# EAGLE design Ring_light_PCB (EAGLE 9.6.0)

## Sheet 1 of 2
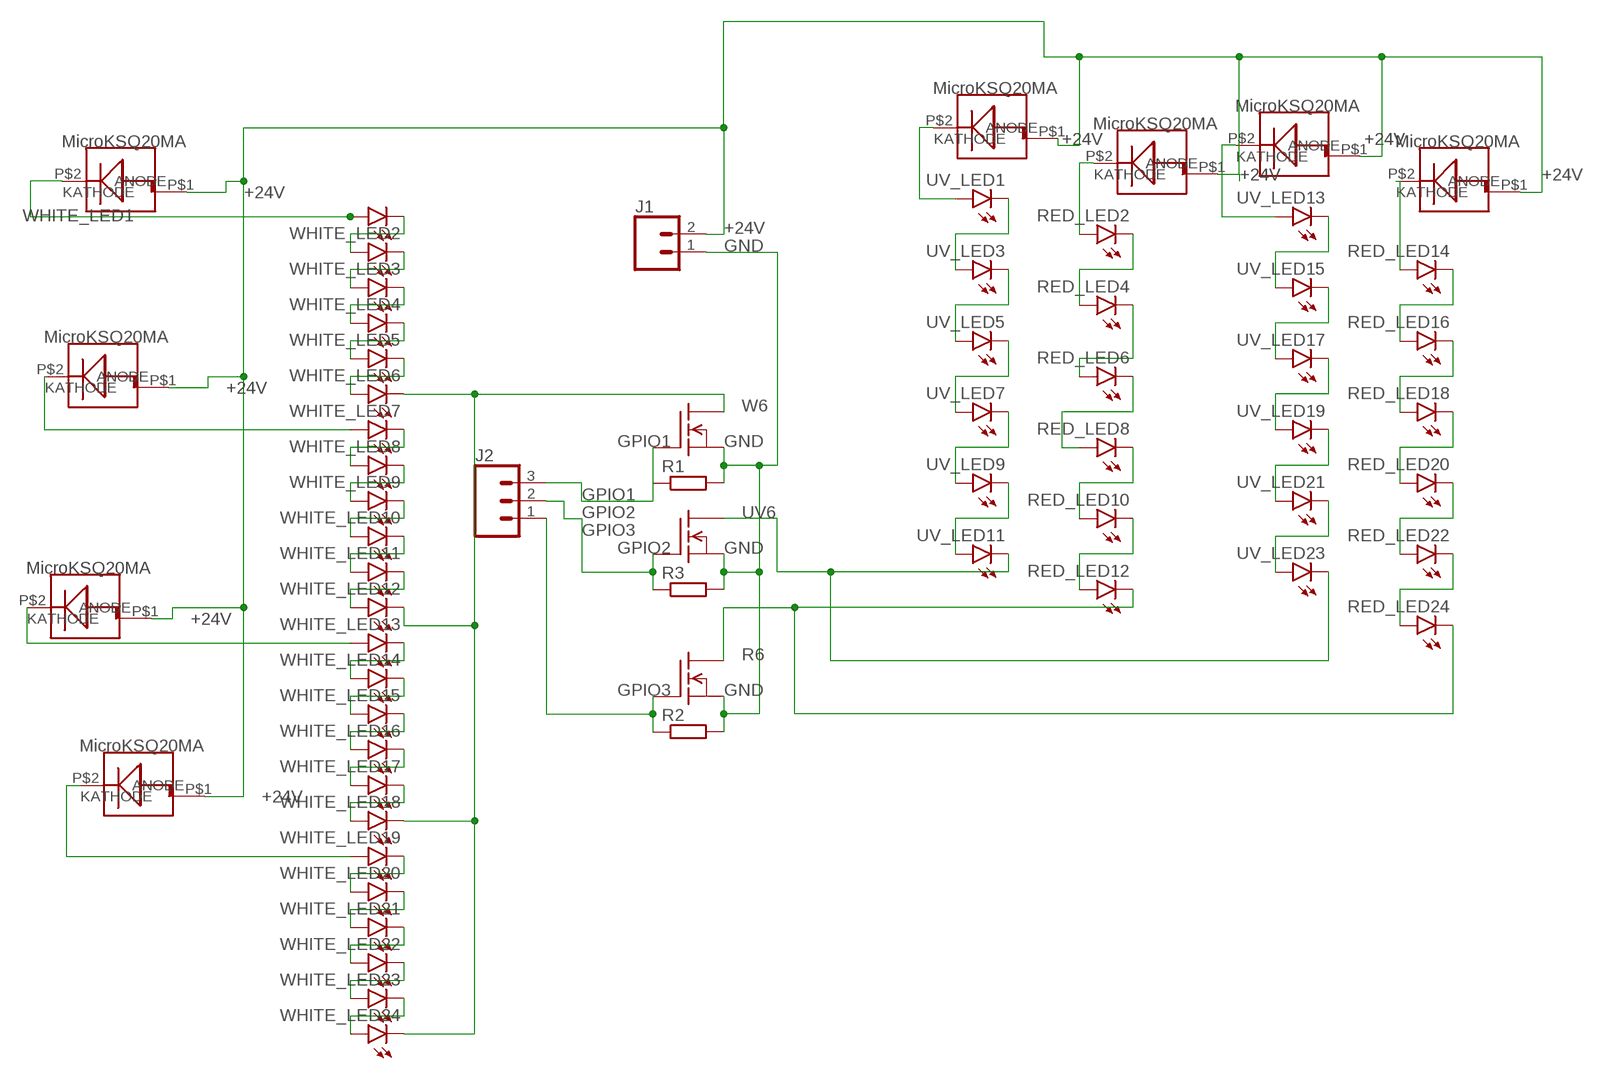
[diagram p0: schematic, sheet 1]

### Parts
J1  CONN_025MM  [SCREWTERMINAL-5MM-2]
J2  CONN_03-SCREW-5MM  [SCREWTERMINAL-5MM-3]
Q1  BUZ10  [TO220]
Q2  BUZ10  [TO220]
Q4  BUZ10  [TO220]
R1  R-EU_0204/7  [0204/7]
R2  R-EU_0204/7  [0204/7]
R3  R-EU_0204/7  [0204/7]
RED_LED2  LED5MM  [LED5MM]
RED_LED4  LED5MM  [LED5MM]
RED_LED6  LED5MM  [LED5MM]
RED_LED8  LED5MM  [LED5MM]
RED_LED10  LED5MM  [LED5MM]
RED_LED12  LED5MM  [LED5MM]
RED_LED14  LED5MM  [LED5MM]
RED_LED16  LED5MM  [LED5MM]
RED_LED18  LED5MM  [LED5MM]
RED_LED20  LED5MM  [LED5MM]
RED_LED22  LED5MM  [LED5MM]
RED_LED24  LED5MM  [LED5MM]
U$1  MICROKSQ220MA  [MICROKSQ20MA]
U$2  MICROKSQ220MA  [MICROKSQ20MA]
U$3  MICROKSQ220MA  [MICROKSQ20MA]
U$4  MICROKSQ220MA  [MICROKSQ20MA]
U$5  MICROKSQ220MA  [MICROKSQ20MA]
U$6  MICROKSQ220MA  [MICROKSQ20MA]
U$7  MICROKSQ220MA  [MICROKSQ20MA]
U$8  MICROKSQ220MA  [MICROKSQ20MA]
UV_LED1  LED5MM  [LED5MM]
UV_LED3  LED5MM  [LED5MM]
UV_LED5  LED5MM  [LED5MM]
UV_LED7  LED5MM  [LED5MM]
UV_LED9  LED5MM  [LED5MM]
UV_LED11  LED5MM  [LED5MM]
UV_LED13  LED5MM  [LED5MM]
UV_LED15  LED5MM  [LED5MM]
UV_LED17  LED5MM  [LED5MM]
UV_LED19  LED5MM  [LED5MM]
UV_LED21  LED5MM  [LED5MM]
UV_LED23  LED5MM  [LED5MM]
WHITE_LED1  LED5MM  [LED5MM]
WHITE_LED2  LED5MM  [LED5MM]
WHITE_LED3  LED5MM  [LED5MM]
WHITE_LED4  LED5MM  [LED5MM]
WHITE_LED5  LED5MM  [LED5MM]
WHITE_LED6  LED5MM  [LED5MM]
WHITE_LED7  LED5MM  [LED5MM]
WHITE_LED8  LED5MM  [LED5MM]
WHITE_LED9  LED5MM  [LED5MM]
WHITE_LED10  LED5MM  [LED5MM]
WHITE_LED11  LED5MM  [LED5MM]
WHITE_LED12  LED5MM  [LED5MM]
WHITE_LED13  LED5MM  [LED5MM]
WHITE_LED14  LED5MM  [LED5MM]
WHITE_LED15  LED5MM  [LED5MM]
WHITE_LED16  LED5MM  [LED5MM]
WHITE_LED17  LED5MM  [LED5MM]
WHITE_LED18  LED5MM  [LED5MM]
WHITE_LED19  LED5MM  [LED5MM]
WHITE_LED20  LED5MM  [LED5MM]
WHITE_LED21  LED5MM  [LED5MM]
WHITE_LED22  LED5MM  [LED5MM]
WHITE_LED23  LED5MM  [LED5MM]
WHITE_LED24  LED5MM  [LED5MM]

### Nets
+24V: J1.2 U$1.P$1(KATHODE) U$2.P$1(KATHODE) U$3.P$1(KATHODE) U$4.P$1(KATHODE) U$5.P$1(KATHODE) U$6.P$1(KATHODE) U$7.P$1(KATHODE) U$8.P$1(KATHODE)
GND: J1.1 Q1.3(S) Q2.3(S) Q4.3(S) R1.2 R2.2 R3.2
GPIO1: J2.3 Q1.1(G) R1.1
GPIO2: J2.2 Q2.1(G) R3.1
GPIO3: J2.1 Q4.1(G) R2.1
R0: RED_LED2.A U$8.P$2(ANODE)
R1: RED_LED2.K(C) RED_LED4.A
R2: RED_LED4.K(C) RED_LED6.A
R3: RED_LED6.K(C) RED_LED8.A
R4: RED_LED8.K(C) RED_LED10.A
R5: RED_LED10.K(C) RED_LED12.A
R6: Q4.2(D) RED_LED12.K(C) RED_LED24.K(C)
R7: RED_LED14.A U$6.P$2(ANODE)
R8: RED_LED14.K(C) RED_LED16.A
R9: RED_LED16.K(C) RED_LED18.A
R10: RED_LED18.K(C) RED_LED20.A
R11: RED_LED20.K(C) RED_LED22.A
R12: RED_LED22.K(C) RED_LED24.A
UV0: U$7.P$2(ANODE) UV_LED1.A
UV1: UV_LED1.K(C) UV_LED3.A
UV2: UV_LED3.K(C) UV_LED5.A
UV3: UV_LED5.K(C) UV_LED7.A
UV4: UV_LED7.K(C) UV_LED9.A
UV5: UV_LED9.K(C) UV_LED11.A
UV6: Q2.2(D) UV_LED11.K(C) UV_LED23.K(C)
UV7: U$5.P$2(ANODE) UV_LED13.A
UV8: UV_LED13.K(C) UV_LED15.A
UV9: UV_LED15.K(C) UV_LED17.A
UV10: UV_LED17.K(C) UV_LED19.A
UV11: UV_LED19.K(C) UV_LED21.A
UV12: UV_LED21.K(C) UV_LED23.A
W0: U$1.P$2(ANODE) WHITE_LED1.A
W1: WHITE_LED1.K(C) WHITE_LED2.A
W2: WHITE_LED2.K(C) WHITE_LED3.A
W3: WHITE_LED3.K(C) WHITE_LED4.A
W4: WHITE_LED4.K(C) WHITE_LED5.A
W5: WHITE_LED5.K(C) WHITE_LED6.A
W6: Q1.2(D) WHITE_LED6.K(C) WHITE_LED12.K(C) WHITE_LED18.K(C) WHITE_LED24.K(C)
W7: U$2.P$2(ANODE) WHITE_LED7.A
W8: WHITE_LED7.K(C) WHITE_LED8.A
W9: WHITE_LED8.K(C) WHITE_LED9.A
W10: WHITE_LED9.K(C) WHITE_LED10.A
W11: WHITE_LED10.K(C) WHITE_LED11.A
W12: WHITE_LED11.K(C) WHITE_LED12.A
W13: U$3.P$2(ANODE) WHITE_LED13.A
W14: WHITE_LED13.K(C) WHITE_LED14.A
W15: WHITE_LED14.K(C) WHITE_LED15.A
W16: WHITE_LED15.K(C) WHITE_LED16.A
W17: WHITE_LED16.K(C) WHITE_LED17.A
W18: WHITE_LED17.K(C) WHITE_LED18.A
W19: U$4.P$2(ANODE) WHITE_LED19.A
W20: WHITE_LED19.K(C) WHITE_LED20.A
W21: WHITE_LED20.K(C) WHITE_LED21.A
W22: WHITE_LED21.K(C) WHITE_LED22.A
W23: WHITE_LED22.K(C) WHITE_LED23.A
W24: WHITE_LED23.K(C) WHITE_LED24.A

## Sheet 2 of 2
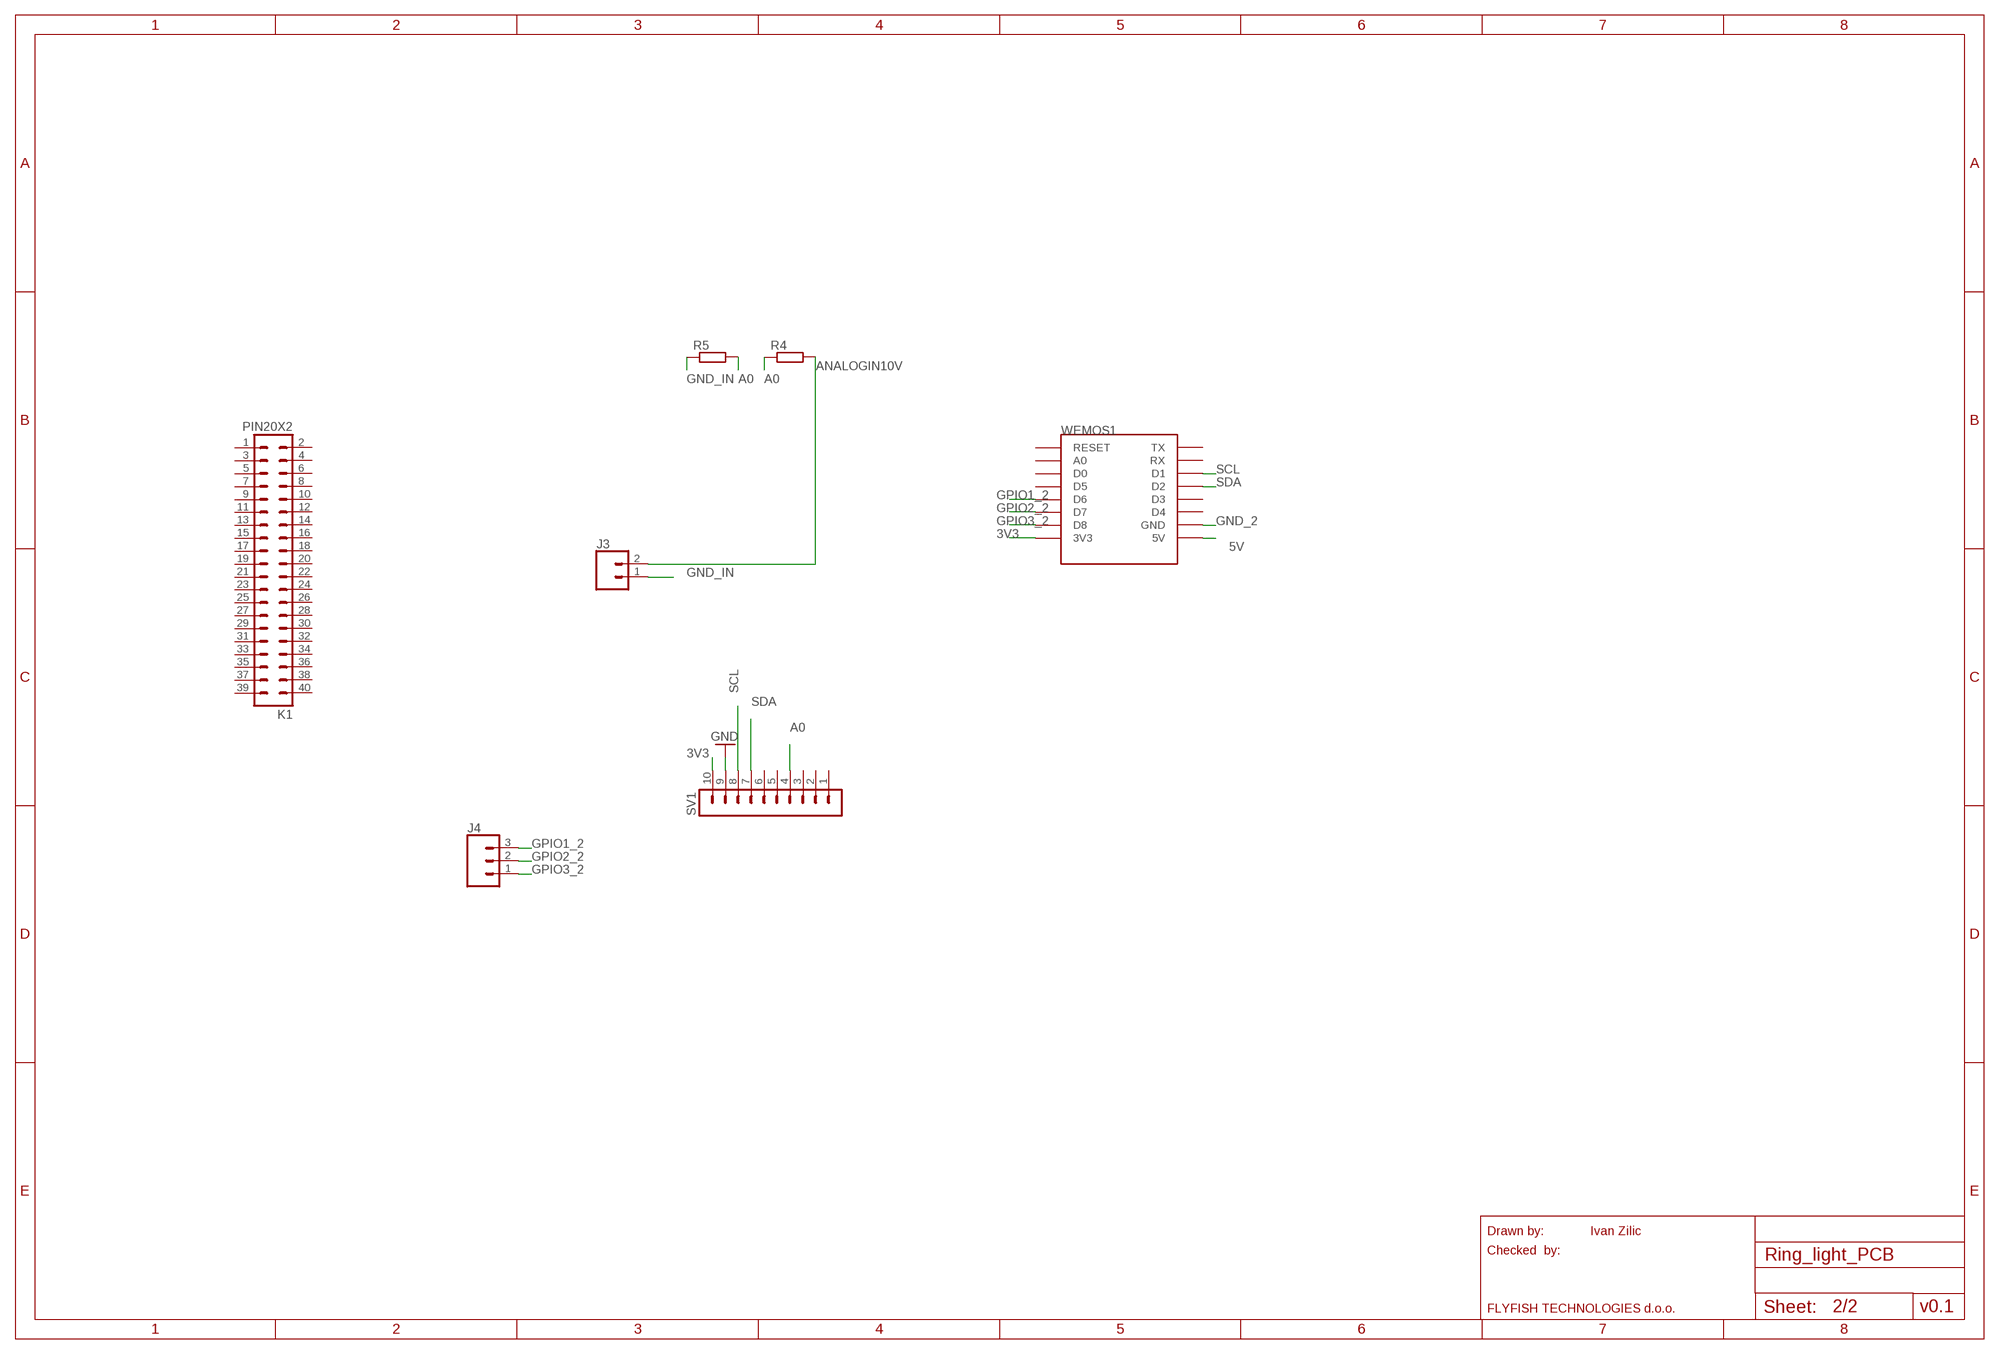
[diagram p1: schematic, sheet 2]

### Parts
J3  CONN_025MM  [SCREWTERMINAL-5MM-2]
J4  CONN_03-SCREW-5MM  [SCREWTERMINAL-5MM-3]
K1  PIN20X2  [PIN_20X2]
R4  R-EU_0204/7  [0204/7]
R5  R-EU_0204/7  [0204/7]
SV1  MA10-1  [MA10-1]
WEMOS1  WEMOS-D1-MINI  [WEMOS-D1-MINI]

### Nets
3V3: SV1.10 WEMOS1.3V3
5V: WEMOS1.5V
A0: R4.1 R5.2 SV1.4
ANALOGIN10V: J3.2 R4.2
GND_2: SV1.9 WEMOS1.GND ; supply symbol labelled GND
GND_IN: J3.1 R5.1
GPIO1_2: J4.3 WEMOS1.D6
GPIO2_2: J4.2 WEMOS1.D7
GPIO3_2: J4.1 WEMOS1.D8
SCL: SV1.8 WEMOS1.D1
SDA: SV1.7 WEMOS1.D2
Unconnected: K1.1 K1.2 K1.3 K1.4 K1.5 K1.6 K1.7 K1.8 K1.9 K1.10 K1.11 K1.12 K1.13 K1.14 K1.15 K1.16 K1.17 K1.18 K1.19 K1.20 K1.21 K1.22 K1.23 K1.24 K1.25 K1.26 K1.27 K1.28 K1.29 K1.30 K1.31 K1.32 K1.33 K1.34 K1.35 K1.36 K1.37 K1.38 K1.39 K1.40 SV1.1 SV1.2 SV1.3 SV1.5 SV1.6 WEMOS1.A0 WEMOS1.D0 WEMOS1.D3 WEMOS1.D4 WEMOS1.D5 WEMOS1.RESET WEMOS1.RX WEMOS1.TX

### Notes on the sheet
- Drawn by: | Ivan Zilic
- Checked  by:
- FLYFISH TECHNOLOGIES d.o.o. | v0.1

## Library data of the parts
J1 J3 = SparkFun-Connectors:CONN_02: Multi connection point. Often used as Generic Header-pin footprint for 0.1 inch spaced/style header connections On any of the 0.1 inch spaced packages, you can populate with these: Break Away Headers - Straight <https://www.sparkfun.com/products/116> (PRT-00116) Break Away Male Headers - Right Angle <https://www.sparkfun.com/products/553> (PRT-00553) Female Headers <https://www.sparkfun.com/products/115> (PRT-00115) Break Away Headers - Machine Pin <https://www.sparkfun.com/products/117> (PRT-00117) Break Away Female Headers - Swiss Machine Pin <https://www.sparkfun.com/products/743> (PRT-00743) For SCREWTERMINALS and SPRING TERMINALS visit here: Screw Terimnals on SparkFun.com <https://www.sparkfun.com/search/results?term=Screw+Terminals> (5mm/3.5mm/2.54mm spacing) This device is also useful as a general connection point to wire up your design to another part of your project. Our various solder wires solder well into these plated through hole pads. Hook-Up Wire - Assortment (Stranded, 22 AWG) <https://www.sparkfun.com/products/11375> (PRT-11375) Hook-Up Wire - Assortment (Solid Core, 22 AWG) <https://www.sparkfun.com/products/11367> (PRT-11367) View the entire wire category on our website here <https://www.sparkfun.com/categories/141> Special notes: Molex polarized connector foot print use with: PRT-08233 with associated crimp pins and housings. 2.54_SCREWTERM for use with PRT-10571. 3.5mm Screw Terminal footprints for PRT-08084 5mm Screw Terminal footprints for use with PRT-08432; SF_SKU: PRT-08432
J2 J4 = SparkFun-Connectors:CONN_03: Multi connection point. Often used as Generic Header-pin footprint for 0.1 inch spaced/style header connections On any of the 0.1 inch spaced packages, you can populate with these: Break Away Headers - Straight <https://www.sparkfun.com/products/116> (PRT-00116) Break Away Male Headers - Right Angle <https://www.sparkfun.com/products/553> (PRT-00553) Female Headers <https://www.sparkfun.com/products/115> (PRT-00115) Break Away Headers - Machine Pin <https://www.sparkfun.com/products/117> (PRT-00117) Break Away Female Headers - Swiss Machine Pin <https://www.sparkfun.com/products/743> (PRT-00743) Stackable Header - 3 Pin (Female, 0.1") <https://www.sparkfun.com/products/13875> (PRT-13875) For SCREWTERMINALS and SPRING TERMINALS visit here: Screw Terimnals on SparkFun.com <https://www.sparkfun.com/search/results?term=Screw+Terminals> (5mm/3.5mm/2.54mm spacing) This device is also useful as a general connection point to wire up your design to another part of your project. Our various solder wires solder well into these plated through hole pads. Hook-Up Wire - Assortment (Stranded, 22 AWG) <https://www.sparkfun.com/products/11375> (PRT-11375) Hook-Up Wire - Assortment (Solid Core, 22 AWG) <https://www.sparkfun.com/products/11367> (PRT-11367) View the entire wire category on our website here <https://www.sparkfun.com/categories/141> Special notes: Molex polarized connector foot print use with SKU : PRT-08232 with associated crimp pins and housings.; PROD_ID: CONN-10134; SF_SKU: PRT-08433
K1 = FLYFISH:PIN20X2
Q1 Q2 Q4 = transistor-fet:BUZ10: N-Channel Enhancement MOSFET 50V; 20A; 0,080Ohm
R1-R5 = rcl:R-EU_: RESISTOR, European symbol; SPICEPREFIX: R
RED_LED2 RED_LED4 RED_LED6 RED_LED8 RED_LED10 RED_LED12 RED_LED14 RED_LED16 RED_LED18 RED_LED20 RED_LED22 RED_LED24 UV_LED1 UV_LED3 UV_LED5 UV_LED7 UV_LED9 UV_LED11 UV_LED13 UV_LED15 UV_LED17 UV_LED19 UV_LED21 UV_LED23 WHITE_LED1-WHITE_LED24 = led:LED: LED OSRAM: - CHIPLED LG R971, LG N971, LY N971, LG Q971, LY Q971, LO R971, LY R971 LH N974, LH R974 LS Q976, LO Q976, LY Q976 LO Q996 - Hyper CHIPLED LW Q18S LB Q993, LB Q99A, LB R99A - SideLED LS A670, LO A670, LY A670, LG A670, LP A670 LB A673, LV A673, LT A673, LW A673 LH A674 LY A675 LS A676, LA A676, LO A676, LY A676, LW A676 LS A679, LY A679, LG A679 - Hyper Micro SIDELED® LS Y876, LA Y876, LO Y876, LY Y876 LT Y87S - SmartLED LW L88C, LW L88S LB L89C, LB L89S, LG L890 LS L89K, LO L89K, LY L89K LS L896, LA L896, LO L896, LY L896 - TOPLED LS T670, LO T670, LY T670, LG T670, LP T670 LSG T670, LSP T670, LSY T670, LOP T670, LYG T670 LG T671, LOG T671, LSG T671 LB T673, LV T673, LT T673, LW T673 LH T674 LS T676, LA T676, LO T676, LY T676, LB T676, LH T676, LSB T676, LW T676 LB T67C, LV T67C, LT T67C, LS T67K, LO T67K, LY T67K, LW E67C LS E67B, LA E67B, LO E67B, LY E67B, LB E67C, LV E67C, LT E67C LW T67C LS T679, LY T679, LG T679 LS T770, LO T770, LY T770, LG T770, LP T770 LB T773, LV T773, LT T773, LW T773 LH T774 LS E675, LA E675, LY E675, LS T675 LS T776, LA T776, LO T776, LY T776, LB T776 LHGB T686 LT T68C, LB T68C - Hyper Mini TOPLED® LB M676 - Mini TOPLED Santana® LG M470 LS M47K, LO M47K, LY M47K Source: http://www.osram.convergy.de LUXEON: - LUMILED® LXK2-PW12-R00, LXK2-PW12-S00, LXK2-PW14-U00, LXK2-PW14-V00 LXK2-PM12-R00, LXK2-PM12-S00, LXK2-PM14-U00 LXK2-PE12-Q00, LXK2-PE12-R00, LXK2-PE12-S00, LXK2-PE14-T00, LXK2-PE14-U00 LXK2-PB12-K00, LXK2-PB12-L00, LXK2-PB12-M00, LXK2-PB14-N00, LXK2-PB14-P00, LXK2-PB14-Q00 LXK2-PR12-L00, LXK2-PR12-M00, LXK2-PR14-Q00, LXK2-PR14-R00 LXK2-PD12-Q00, LXK2-PD12-R00, LXK2-PD12-S00 LXK2-PH12-R00, LXK2-PH12-S00 LXK2-PL12-P00, LXK2-PL12-Q00, LXK2-PL12-R00 Source: www.luxeon.com KINGBRIGHT: KA-3528ASYC Source: www.kingbright.com
SV1 = con-lstb:MA10-1: PIN HEADER; OC_FARNELL: unknown; OC_NEWARK: unknown
U$1-U$8 = mylib:MICROKSQ220MA
WEMOS1 = esp8266modules:WEMOS-D1-MINI: WeMos.cc D1 mini ESP8266 module

## Board
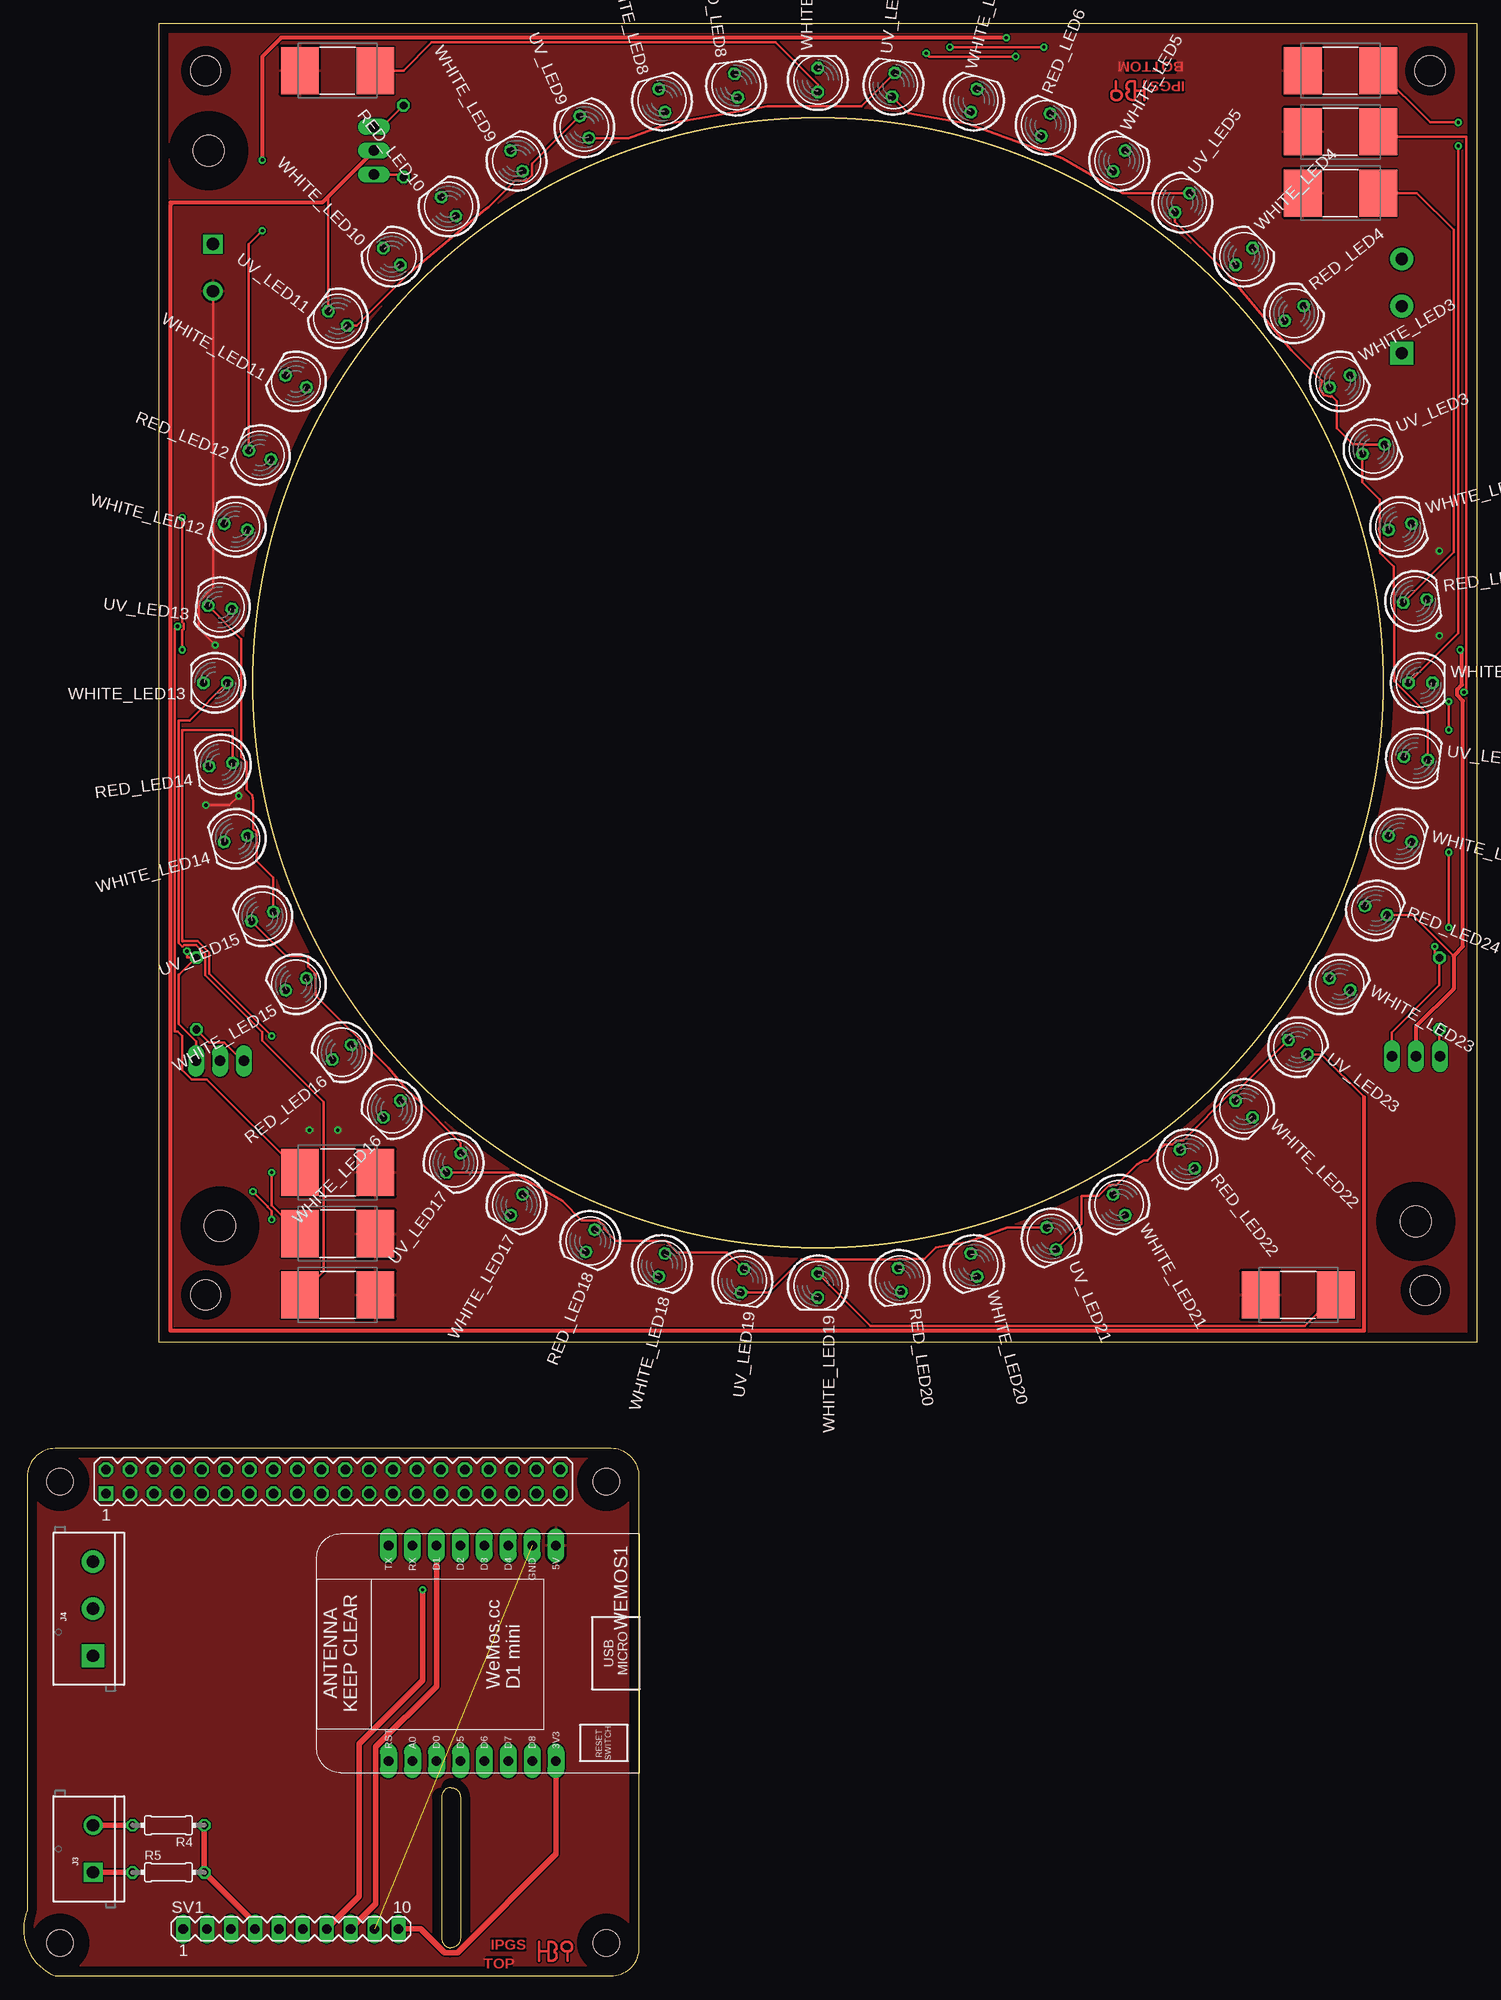
[diagram p2: board, top side]
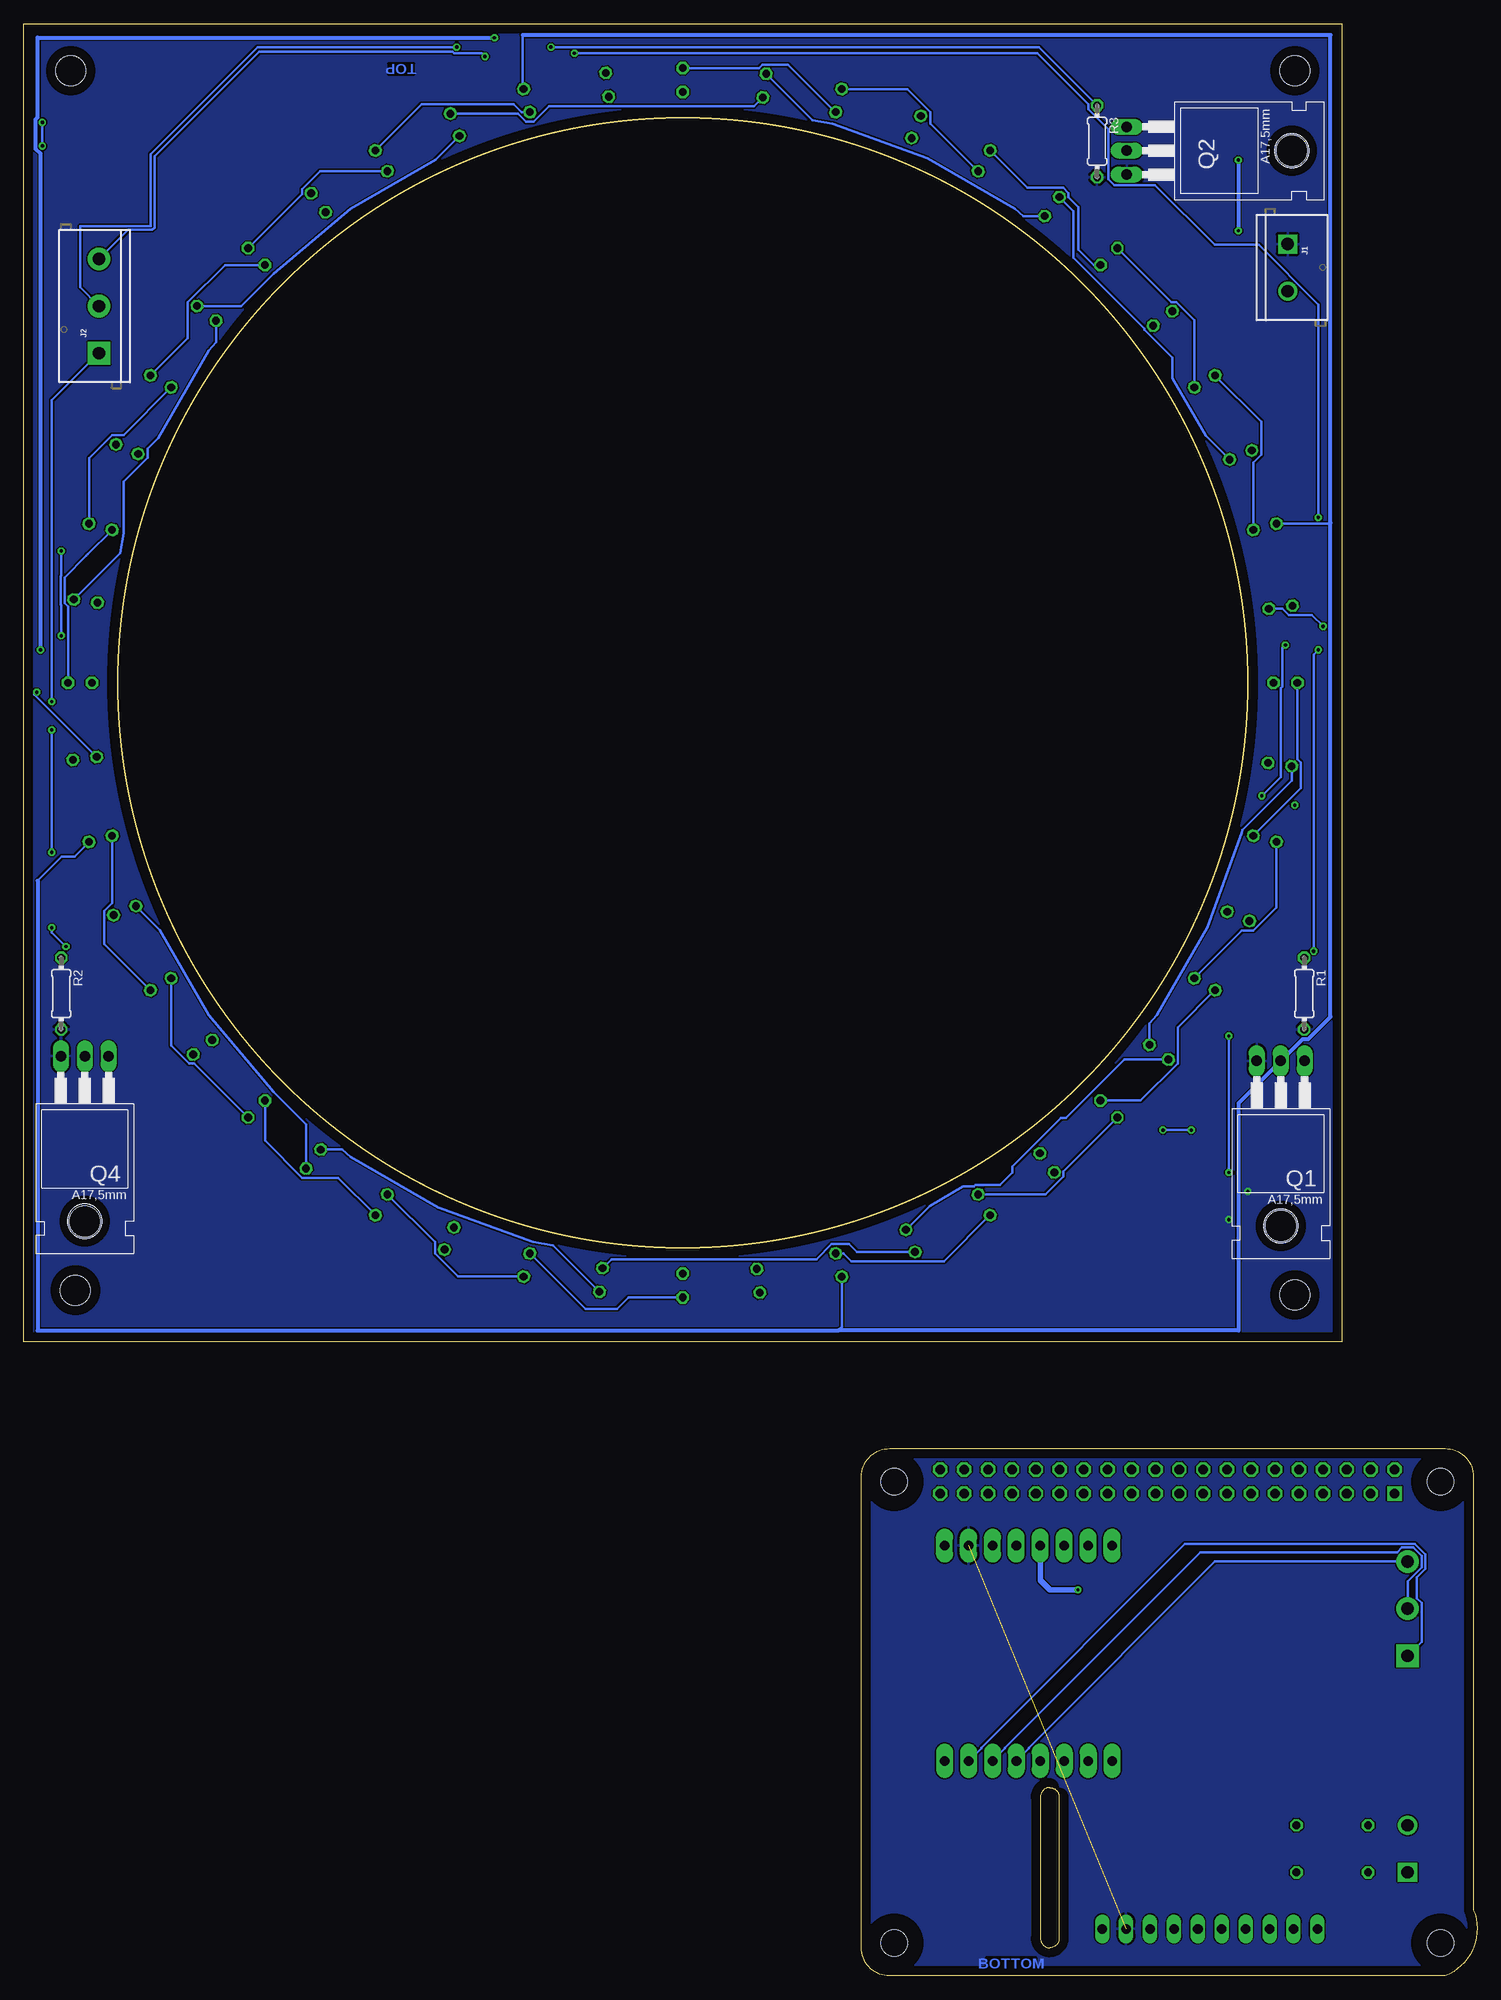
[diagram p3: board, bottom side, seen from below]

Size 154.35 x 207.31 mm. Coordinates in mm from the lower left corner, seen from the top.
Outline: 44.38,19 44.38,4 arc90 45.38,3 arc90 46.38,4 46.38,19 arc90 45.38,20
Outline: 14.35,67.31 154.35,67.31 154.35,207.31 14.35,207.31 14.35,67.31
Outline: 0.38,7 arc90 3.38,0 62.38,0 arc90 65.38,3 65.38,53 arc90 62.38,56 3.38,56 arc90 0.38,53 0.38,7
Outline: circle at 84.35,137.31 radius 60
Copper layers (1*16): Top 0.035mm / dielectric 1.5mm / Bottom 0.035mm
Design rules "default": minimum track width 6mil, minimum drill 0.35mm, track to track 6mil, track to pad 6mil, pad to pad 6mil, via to via 6mil, smd to smd 6mil, copper to edge 40mil, drill to drill 6mil, minimum pad ring 10mil, minimum via ring 8mil, stop-mask expansion 4mil, vias tented up to drill 0mil, thermal gap 10mil
Holes 3.2 mm at 19.35,202.31 149.35,202.31 148.85,72.81 19.35,72.31
Holes 2.8 mm at 3.88,3.5 3.88,52.5 61.88,52.5 61.88,3.5
tRestrict: area 2.3,51 to 5.4,54.1; area 60.3,51 to 63.4,54.1; area 60.3,2 to 63.4,5; area 2.3,2 to 5.4,5
bRestrict: area 2.3,2 to 5.4,5; area 2.3,51 to 5.4,54.1; area 60.3,2 to 63.4,5; area 60.3,51 to 63.4,54.1
Milling: 6 lines

### Footprints (pad centres in the part's own frame; a part is rotated, then mirrored left to right if it is on the bottom)
SCREWTERMINAL-5MM-2 = drill 1.3 pad 2.032 square: 1 0,0 | drill 1.3 pad 2.032: 2 5,0
SCREWTERMINAL-5MM-3 = drill 1.3 pad 2.413 square: 1 0,0 | drill 1.3 pad 2.413: 2 5,0; 3 10,0
PIN_20X2 = drill 1.016 square: 1 -24.13,-1.27 | drill 1.016 octagon: 2 -24.13,1.27; 3 -21.59,-1.27; 4 -21.59,1.27; 5 -19.05,-1.27; 6 -19.05,1.27; 7 -16.51,-1.27; 8 -16.51,1.27; 9 -13.97,-1.27; 10 -13.97,1.27; 11 -11.43,-1.27; 12 -11.43,1.27; 13 -8.89,-1.27; 14 -8.89,1.27; 15 -6.35,-1.27; 16 -6.35,1.27; 17 -3.81,-1.27; 18 -3.81,1.27; 19 -1.27,-1.27; 20 -1.27,1.27; 21 1.27,-1.27; 22 1.27,1.27; 23 3.81,-1.27; 24 3.81,1.27; 25 6.35,-1.27; 26 6.35,1.27; 27 8.89,-1.27; 28 8.89,1.27; 29 11.43,-1.27; 30 11.43,1.27; 31 13.97,-1.27; 32 13.97,1.27; 33 16.51,-1.27; 34 16.51,1.27; 35 19.05,-1.27; 36 19.05,1.27; 37 21.59,-1.27; 38 21.59,1.27; 39 24.13,-1.27; 40 24.13,1.27
TO220 = drill 1.118 long: 1 -2.54,-6.35; 2 0,-6.35; 3 2.54,-6.35 | hole 3.302: 0,11.176
0204/7 = drill 0.813 octagon: 1 -3.81,0; 2 3.81,0
LED5MM = drill 0.813 octagon: A -1.27,0; K 1.27,0
MA10-1 = drill 1.016 long: 1 -11.43,0; 2 -8.89,0; 3 -6.35,0; 4 -3.81,0; 5 -1.27,0; 6 1.27,0; 7 3.81,0; 8 6.35,0; 9 8.89,0; 10 11.43,0
MICROKSQ20MA = smd 4 x 5: P$1 0,2.5; P$2 8,2.5
WEMOS-D1-MINI = drill 1.016 pad 1.829 long: 3V3 -10.16,-10.16; 5V 12.7,-10.16; A0 -10.16,5.08; D0 -10.16,2.54; D1 12.7,2.54; D2 12.7,0; D3 12.7,-2.54; D4 12.7,-5.08; D5 -10.16,0; D6 -10.16,-2.54; D7 -10.16,-5.08; D8 -10.16,-7.62; GND 12.7,-7.62; RESET -10.16,7.62; RX 12.7,5.08; TX 12.7,7.62

### Placement (x,y rotation side)
J1  20.11,183.9 270 bottom
J2  146.35,172.31 90 bottom
J3  7.38,11 90 top
J4  7.38,34 90 top
K1  32.88,52.5 0 top
Q1  20.85,90.81 180 bottom
Q2  30.85,193.81 270 bottom
Q4  147.85,91.31 180 bottom
R1  18.35,104.31 270 bottom
R2  150.35,104.31 270 bottom
R3  40.35,194.81 270 bottom
R4  15.38,16 180 top
R5  15.38,11 0 top
RED_LED2  147.76,146 7.8 top
RED_LED4  134.92,176.54 37.8 top
RED_LED6  108.54,196.57 67.8 top
RED_LED8  75.67,200.72 97.8 top
RED_LED10  45.13,187.88 127.8 top
RED_LED12  25.1,161.49 157.8 top
RED_LED14  20.95,128.62 187.8 top
RED_LED16  33.78,98.08 217.8 top
RED_LED18  60.17,78.05 247.8 top
RED_LED20  93.04,73.9 277.8 top
RED_LED22  123.58,86.74 307.8 top
RED_LED24  143.61,113.13 337.8 top
SV1  28.38,5 0 top
U$1  135.85,199.81 0 top
U$2  29.35,199.81 0 top
U$3  37.35,74.81 180 top
U$4  131.35,69.81 0 top
U$5  37.35,87.81 180 top
U$6  37.35,81.31 180 top
U$7  135.85,193.31 0 top
U$8  135.85,186.81 0 top
UV_LED1  147.85,129.29 352.8 top
UV_LED3  143.35,162.11 22.8 top
UV_LED5  123.05,188.29 52.8 top
UV_LED7  92.38,200.81 82.8 top
UV_LED9  59.55,196.31 112.8 top
UV_LED11  33.38,176 142.8 top
UV_LED13  20.86,145.33 172.8 top
UV_LED15  25.36,112.51 202.8 top
UV_LED17  45.66,86.33 232.8 top
UV_LED19  76.33,73.81 262.8 top
UV_LED21  109.16,78.31 292.8 top
UV_LED23  135.33,98.62 322.8 top
WEMOS1  46.38,33 90 top
WHITE_LED1  148.35,137.31 0 top
WHITE_LED2  146.17,153.87 15 top
WHITE_LED3  139.78,169.31 30 top
WHITE_LED4  129.61,182.56 45 top
WHITE_LED5  116.35,192.74 60 top
WHITE_LED6  100.92,199.13 75 top
WHITE_LED7  84.35,201.31 90 top
WHITE_LED8  67.79,199.13 105 top
WHITE_LED9  52.35,192.74 120 top
WHITE_LED10  39.1,182.56 135 top
WHITE_LED11  28.93,169.31 150 top
WHITE_LED12  22.54,153.87 165 top
WHITE_LED13  20.35,137.31 180 top
WHITE_LED14  22.54,120.75 195 top
WHITE_LED15  28.93,105.31 210 top
WHITE_LED16  39.1,92.06 225 top
WHITE_LED17  52.35,81.88 240 top
WHITE_LED18  67.79,75.49 255 top
WHITE_LED19  84.35,73.31 270 top
WHITE_LED20  100.92,75.49 285 top
WHITE_LED21  116.35,81.88 300 top
WHITE_LED22  129.61,92.06 315 top
WHITE_LED23  139.78,105.31 330 top
WHITE_LED24  146.17,120.75 345 top

### Tracks (layer width: path | path; a pad name or v marks a point on that pad's centre or on a via)
3V3
  Top 0.61: SV1.10 42.17,5 44.73,2.44 45.62,2.44 45.64,2.46 45.79,2.49 46.09,2.49 56.54,12.95 WEMOS1.3V3
5V
  pour Top: 0.38,3 arc90 3.38,0 62.38,0 arc90 65.38,3 65.38,53 arc90 62.38,56 3.38,56 arc90 0.38,53
+24V  (via drill 0.35)
  Top 0.254: J1.2 20.11,147.39 18.62,145.9 18.62,143.05 v20.35,141.31 | v22.85,125.31 21.85,124.31 v19.35,124.31
  Bottom 0.254: v20.35,141.31 20.68,140.98 20.68,136.92 20.85,136.75 20.85,127.31 v22.85,125.31 | v150.35,151.31 150.35,148.71 150.41,148.66 150.41,145.62 150.35,145.56 v150.35,142.31 | v33.35,89.81 v30.35,89.81
  pour Top: 170.35,217.81 3.35,217.81 3.35,61.81 170.35,61.81
A0
  Top 0.61: R4.1 R5.2 24.57,5.62 SV1.4
ANALOGIN10V
  Top 0.61: J3.2 R4.2
GND  (via drill 0.35)
  Top 0.254: R1.2 19.74,99.12 21.32,99.12 23.27,97.16 Q1.3 | R2.2 150.35,97.7 Q4.3 | Q2.3 40.08,191.27 R3.2 | v24.35,83.31 25.95,81.72 25.95,81.64 26.35,81.23 v26.35,80.31
  pour Bottom: -2.15,56.81 163.85,56.81 163.85,213.81 -2.15,213.81
GND_2  (1 unrouted)
  pour Bottom: 0.38,3 arc90 3.38,0 62.38,0 arc90 65.38,3 65.38,53 arc90 62.38,56 3.38,56 arc90 0.38,53
GND_IN
  Top 0.61: J3.1 R5.1
GPIO1  (via drill 0.35)
  Top 0.254: Q1.1 18.31,99.21 16.46,101.06 16.46,106.31 16.54,106.31 R1.1 17.35,108.12 v17.35,108.81 | v105.35,203.81 96.2,203.81 v95.85,204.15 | v16.85,154.86 16.85,143.74 17.01,143.58 17.01,143.04 16.85,142.88 v16.85,140.81
  Bottom 0.254: v105.35,203.81 105.7,204.15 108.63,204.15 108.78,204.31 129.35,204.31 140.45,193.22 140.45,185.64 140.69,185.4 143.26,185.4 J2.3 | v95.85,204.15 46.7,204.15 41.29,198.75 41.29,198.23 39.16,196.1 39.16,190.81 38.51,190.15 34.2,190.15 27.85,183.81 23.19,183.81 16.85,177.47 v16.85,154.86 | v16.85,140.81 17.35,140.31 v17.35,108.81
GPIO1_2
  Bottom 0.254: WEMOS1.D6 47.58,24.19 47.58,24.25 27.83,44 J4.3
GPIO2  (via drill 0.35)
  Top 0.254: Q2.1 38.08,196.35 R3.1 | v98.35,204.81 v108.35,204.81
  Bottom 0.254: R3.1 46.54,204.81 v98.35,204.81 | v108.35,204.81 129.47,204.81 140.85,193.43 140.85,185.81 148.35,185.81 148.35,179.31 J2.2
GPIO2_2
  Bottom 0.254: WEMOS1.D7 50.12,24.19 50.12,24.25 29.37,45 8.49,45 8,45.49 6.77,45.49 5.9,44.62 5.9,43.39 7.38,41.9 J4.2
GPIO3  (via drill 0.35)
  Top 0.254: Q4.1 145.31,100.16 150.35,105.2 R2.1 149.85,108.62 v149.85,109.31 | v151.35,135.31 v151.35,132.31 | v151.35,119.31 v151.35,111.31
  Bottom 0.254: v151.35,132.31 v151.35,119.31 | v151.35,111.31 151.35,110.81 v149.85,109.31 | J2.1 151.35,167.31 v151.35,135.31
GPIO3_2
  Bottom 0.254: WEMOS1.D8 52.66,24.19 52.66,24.25 31.01,45.89 6.6,45.89 5.49,44.78 5.49,43.22 6.38,42.32 6.38,40.1 5.9,39.62 5.9,35.49 J4.1
N$1
  Top 0.254: 54.74,1.62 54.74,2.62 | 54.74,2.62 54.74,3.62 | 54.74,2.62 55.74,2.62 | 55.74,2.62 55.74,1.62 56.12,1.62 arc90 56.62,2.12 56.62,2.25 arc90 56.37,2.5 56.37,2.75 arc90 56.62,3 arc90 55.99,3.62 55.74,3.62 55.74,2.62
N$2
  Top 0.254: 57.74,1.62 57.74,2.62 | 57.74,2.62 57.87,2.62 arc90 58.24,3 58.24,3.12 arc90 57.74,3.62 57.62,3.62 arc90 57.12,3.12 arc103 57.74,2.62
N$7
  Top 0.254: 118.99,201.19 118.99,200.19 | 118.99,200.19 118.99,199.19 | 118.99,200.19 117.99,200.19 | 117.99,200.19 117.99,201.19 117.62,201.19 arc90 117.12,200.69 117.12,200.56 arc90 117.37,200.31 117.37,200.06 arc90 117.12,199.81 arc90 117.74,199.19 117.99,199.19 117.99,200.19
N$8
  Top 0.254: 115.99,201.19 115.99,200.19 | 115.99,200.19 115.87,200.19 arc90 115.49,199.81 115.49,199.69 arc90 115.99,199.19 116.12,199.19 arc90 116.62,199.69 arc103 115.99,200.19
R0
  Top 0.254: U$8.P$2 147.95,189.31 151.85,185.4 151.85,151.17 RED_LED2.A
R1
  Bottom 0.254: RED_LED2.K 144.09,151.1 143.71,153.22 143.71,158.65 141.17,161.2 141.17,162.17 140.05,163.28 134.69,172.56 133.92,173.48 RED_LED4.A
R2
  Bottom 0.254: RED_LED6.A 110.6,192.85 119.6,187.65 127.81,180.76 131.26,177.31 RED_LED4.K
R3
  Bottom 0.254: RED_LED6.K 101.86,197.74 101.01,196.89 100.17,196.89 98.54,198.53 76.77,198.53 RED_LED8.A
R4
  Bottom 0.254: RED_LED8.K 70.56,197.04 68.45,196.67 58.38,193 49.11,187.65 48.19,186.88 RED_LED10.A
R5
  Bottom 0.254: RED_LED10.K 42.85,187.39 42.85,182.45 35.34,174.94 35.34,174.8 32.35,171.81 32.35,169.68 28.82,163.55 RED_LED12.A
R6  (via drill 0.35)
  Top 0.254: RED_LED24.K 147.52,112.65 151.85,108.31 | v25.35,185.31 23.92,183.88 RED_LED12.K
  Top 0.406: Q4.2 147.85,100.81 151.85,104.81 151.85,108.31 152.85,109.31 152.85,135.38 152.23,136.01 152.23,136.61 152.73,137.12 152.73,140.81 v152.55,140.81 | v104.35,205.81 27.35,205.81 25.35,203.81 v25.35,192.81
  Bottom 0.406: v152.55,140.81 152.55,193.47 153.09,194.01 153.09,197.11 152.85,197.35 152.85,205.81 v104.35,205.81 | v25.35,192.81 v25.35,185.31
R7  (via drill 0.35)
  Top 0.254: U$6.P$2 26.35,81.81 v26.35,85.31 | v26.35,99.81 19.7,106.46 19.7,108.68 18.5,109.87 16.91,109.87 16.89,109.85 16.87,109.87 16.87,132.31 22.19,132.31 22.2,132.3 RED_LED14.A
  Bottom 0.254: v26.35,85.31 v26.35,99.81
R8
  Bottom 0.254: RED_LED14.K 19.69,126.95 24.94,121.7 25,121.41 28.66,111.34 34.02,102.06 34.79,101.14 RED_LED16.A
R9
  Bottom 0.254: RED_LED16.K 37.45,97.31 43.65,91.1 44.18,91.1 49.35,85.93 49.35,85.31 50.67,83.99 53.26,83.99 53.44,83.81 54.58,83.81 58.11,81.77 RED_LED18.A
R10
  Bottom 0.254: RED_LED18.K 65.85,76.88 66.7,77.73 68.54,77.73 70.17,76.09 91.94,76.09 RED_LED20.A
R11
  Bottom 0.254: RED_LED20.K 98.15,77.58 100.26,77.95 110.33,81.62 119.6,86.97 120.52,87.74 RED_LED22.A
R12
  Bottom 0.254: RED_LED24.A 139.89,111.07 134.69,102.06 127.81,93.86 124.36,90.41 RED_LED22.K
SCL
  Top 0.61: WEMOS1.D1 43.84,30.77 37.39,24.32 37.39,7.66 SV1.8
SDA  (via drill 0.35)
  Top 0.61: v42.38,41 42.38,31.39 35.63,24.64 35.63,8.44 SV1.7
  Bottom 0.61: WEMOS1.D2 46.38,42 45.38,41 v42.38,41
UV0  (via drill 0.35)
  Top 0.254: U$7.P$2 143.35,195.31 153.21,195.31 153.21,136.56 v152.96,136.31
  Bottom 0.254: UV_LED1.A 153.21,136.07 153.21,136.31 v152.96,136.31
UV1
  Top 0.254: UV_LED1.K 149.11,133.96 145.57,137.49 145.57,145.69 145.52,145.74 145.52,149.64 144.09,151.07 144.04,151.34 144.04,153.29 143.94,153.68 144.04,153.86 144.04,156.78 142.18,158.64 UV_LED3.A
UV2
  Top 0.254: UV_LED5.A 122.28,186.29 127.81,180.76 133.28,174.25 134.64,172.63 137.87,169.39 137.87,169.29 137.67,168.54 138.06,167.87 138.81,167.67 138.91,167.72 139.43,167.2 139.43,164.35 141.15,162.64 142.23,162.64 142.26,162.6 UV_LED3.K
UV3
  Top 0.254: UV_LED5.K 116.74,189.3 110.33,193 100.26,196.67 93.99,197.78 UV_LED7.A
UV4
  Top 0.254: UV_LED7.K 89,198.53 79,198.53 68.45,196.67 64.24,195.14 UV_LED9.A
UV5
  Top 0.254: UV_LED9.K 54,192.42 54,191.22 53.41,190.63 52.21,190.63 49.4,187.82 49.11,187.65 40.9,180.76 35.37,175.24 UV_LED11.A
UV6
  Top 0.254: Q2.2 32.36,188.97 UV_LED11.K | 142.35,93.31 137.82,97.85 UV_LED23.K
  Top 0.406: Q2.2 31.7,188.31 15.85,188.31 | 15.85,188.31 15.57,188.31 | 15.85,188.31 15.57,188.03 15.57,68.53 142.35,68.53 142.35,93.31
UV7  (via drill 0.35)
  Top 0.254: U$5.P$2 19.46,95.2 17.85,95.2 16.85,96.2 16.85,99.81 16.35,100.31 16.06,100.31 16.06,143.01 v16.35,143.31
  Bottom 0.254: UV_LED13.A 20.67,145.17 20.01,144.51 17.55,144.51 v16.35,143.31
UV8
  Top 0.254: UV_LED13.K 23.14,141.95 23.14,129.43 23.69,128.88 23.69,125.98 24.3,125.37 24.41,124.73 24.41,121.85 24.77,121.49 24.77,118.39 26.53,116.64 UV_LED15.A
UV9
  Top 0.254: UV_LED15.K 27.89,108.31 30.23,108.31 30.23,107.16 31.04,106.36 31.04,104.13 38.77,96.39 40.9,93.86 41.78,93.12 46.43,88.47 UV_LED17.A
UV10
  Top 0.254: UV_LED17.K 51.98,85.31 57.25,82.27 59.27,80.25 61.07,80.25 61.64,79.68 61.64,79.31 62.92,78.03 66.07,78.03 66.35,78.03 68.23,78.03 69.42,76.84 74.72,76.84 UV_LED19.A
UV11
  Top 0.254: UV_LED19.K 79.1,72.56 82.64,76.09 92.74,76.09 92.79,76.14 95.69,76.14 96.9,77.36 100.26,77.95 104.47,79.48 UV_LED21.A
UV12
  Top 0.254: UV_LED21.K 112.35,79.85 112.35,82.78 112.38,82.81 114.12,82.81 115.3,83.99 116.04,83.99 118.21,86.17 118.97,86.61 | 118.97,86.61 | 118.97,86.61 119.35,86.61 120.32,87.58 121.2,88.31 122,88.31 122.41,88.72 123.15,88.72 128.32,93.89 128.83,93.89 UV_LED23.A
W0  (via drill 0.35)
  Top 0.254: U$1.P$2 149.35,196.81 v152.35,196.81 | v152.35,194.31 152.35,142.58 WHITE_LED1.A
  Bottom 0.254: v152.35,196.81 v152.35,194.31
W1
  Bottom 0.254: WHITE_LED2.A 147.52,150.97 147.68,150.81 150,148.49 150,145.79 149.62,145.41 WHITE_LED1.K
W2
  Bottom 0.254: WHITE_LED3.A 143.73,163.62 144.95,163.62 147.4,161.17 WHITE_LED2.K
W3
  Bottom 0.254: WHITE_LED4.A 132.96,181.67 136.91,177.72 136.91,173.92 WHITE_LED3.K
W4
  Bottom 0.254: WHITE_LED4.K 124.78,189.19 124.78,189.73 122.87,191.64 WHITE_LED5.A
W5
  Bottom 0.254: WHITE_LED6.A 101.44,197.9 102.3,198.76 112.07,198.76 WHITE_LED5.K
W6
  Bottom 0.254: 101.35,206.09 101.35,200.46 WHITE_LED6.K | WHITE_LED12.K 15.68,154.2 15.57,154.31 | WHITE_LED18.K 67.46,68.92 67.85,68.53 | WHITE_LED24.K 148.93,118.89 150.28,118.89 152.85,116.31
  Bottom 0.406: 101.35,206.09 15.57,206.09 15.57,154.31 15.57,101.84 17.93,99.48 18.52,99.48 20.84,97.16 Q1.2 25.35,92.66 25.35,68.53 67.85,68.53 152.85,68.53 152.85,116.31
W7
  Top 0.254: U$2.P$2 40.35,202.31 43.35,205.31 79.85,205.31 84.35,200.81 WHITE_LED7.A
W8
  Bottom 0.254: WHITE_LED7.K 76.26,202.58 75.88,202.96 73.18,202.96 WHITE_LED8.A
W9
  Bottom 0.254: WHITE_LED8.K 60.5,200.36 58.04,197.9 58.04,196.69 WHITE_LED9.A
W10
  Bottom 0.254: WHITE_LED9.K 47.75,189.87 43.94,189.87 43.39,189.31 43.39,188.85 42.35,187.81 42.35,183.31 40.71,181.67 WHITE_LED10.A
W11
  Bottom 0.254: WHITE_LED10.K 32.47,177.74 31.94,177.74 30.03,175.83 WHITE_LED11.A
W12
  Bottom 0.254: WHITE_LED12.A 23.76,160.69 22.91,161.55 22.91,165.02 WHITE_LED11.K
W13
  Top 0.254: U$3.P$2 31.85,74.81 31.85,92.81 25.35,99.31 25.35,100.23 19.29,106.3 19.29,108.51 18.34,109.47 17.08,109.47 16.92,109.31 16.85,109.31 16.46,109.7 16.46,133.31 17.62,133.31 WHITE_LED13.A
W14
  Bottom 0.254: WHITE_LED13.K 19.08,129.21 18.7,128.83 18.7,126.13 WHITE_LED14.A
W15
  Bottom 0.254: WHITE_LED15.A 24.97,111 23.76,111 21.31,113.45 WHITE_LED14.K
W16
  Bottom 0.254: WHITE_LED16.A 35.75,92.95 31.8,96.9 31.8,100.7 WHITE_LED15.K
W17
  Bottom 0.254: WHITE_LED16.K 43.93,85.43 43.93,84.89 45.84,82.98 WHITE_LED17.A
W18
  Bottom 0.254: WHITE_LED18.A 67.27,76.72 66.41,75.86 56.64,75.86 WHITE_LED17.K
W19
  Top 0.254: U$4.P$2 139.35,71.81 139.85,72.31 139.85,72.81 136.06,69.01 89.92,69.01 WHITE_LED19.A
W20
  Bottom 0.254: WHITE_LED19.K 90.12,72.04 91.35,70.81 94.68,70.81 WHITE_LED20.A
W21
  Bottom 0.254: WHITE_LED21.A 110.66,77.93 110.66,76.72 108.21,74.26 WHITE_LED20.K
W22
  Bottom 0.254: WHITE_LED22.A 128.71,88.7 124.77,84.75 120.96,84.75 WHITE_LED21.K
W23
  Bottom 0.254: WHITE_LED22.K 136.23,96.88 136.77,96.88 138.68,98.79 WHITE_LED23.A
W24
  Bottom 0.254: WHITE_LED24.A 144.95,113.93 145.8,113.07 145.8,109.6 WHITE_LED23.K

### Text on the board
Top: BOTTOM | IPGS | IPGS | TOP
Bottom: TOP | BOTTOM